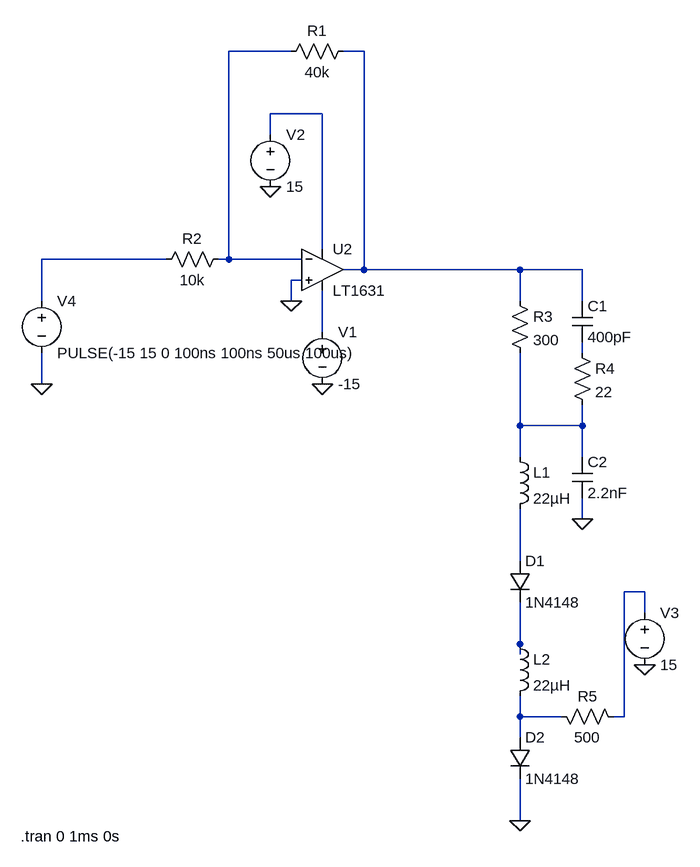
[diagram p0: schematic opamp_pindiodedriver_ltspice.asc]
opamp_pindiodedriver_ltspice.asc, the LTspice schematic file:
Version 4
SHEET 1 880 1016
WIRE 112 -208 16 -208
WIRE 224 -208 192 -208
WIRE 160 -112 80 -112
WIRE 80 -80 80 -112
WIRE 160 96 160 -112
WIRE -80 112 -272 112
WIRE 16 112 16 -208
WIRE 16 112 0 112
WIRE 128 112 16 112
WIRE 224 128 224 -208
WIRE 224 128 192 128
WIRE 464 128 224 128
WIRE 560 128 464 128
WIRE 128 144 112 144
WIRE -272 176 -272 112
WIRE 112 176 112 144
WIRE 464 176 464 128
WIRE 560 176 560 128
WIRE 160 224 160 160
WIRE 560 256 560 240
WIRE -272 304 -272 256
WIRE 464 368 464 256
WIRE 560 368 560 336
WIRE 560 368 464 368
WIRE 464 416 464 368
WIRE 560 416 560 368
WIRE 560 512 560 480
WIRE 464 576 464 496
WIRE 656 624 624 624
WIRE 656 656 656 624
WIRE 464 704 464 640
WIRE 464 720 464 704
WIRE 464 816 464 784
WIRE 528 816 464 816
WIRE 624 816 624 624
WIRE 624 816 608 816
WIRE 464 848 464 816
WIRE 464 976 464 912
FLAG 80 0 0
FLAG 160 304 0
FLAG 560 512 0
FLAG 464 976 0
FLAG 656 736 0
FLAG -272 304 0
FLAG 112 176 0
SYMBOL Opamps\\LT1631 160 64 R0
SYMATTR InstName U2
SYMBOL voltage 160 208 R0
WINDOW 123 0 0 Left 2
WINDOW 39 0 0 Left 2
SYMATTR InstName V1
SYMATTR Value -15
SYMBOL voltage 80 -96 R0
WINDOW 123 0 0 Left 2
WINDOW 39 0 0 Left 2
SYMATTR InstName V2
SYMATTR Value 15
SYMBOL res 208 -224 R90
WINDOW 0 0 56 VBottom 2
WINDOW 3 32 56 VTop 2
SYMATTR InstName R1
SYMATTR Value 40k
SYMBOL res 16 96 R90
WINDOW 0 0 56 VBottom 2
WINDOW 3 32 56 VTop 2
SYMATTR InstName R2
SYMATTR Value 10k
SYMBOL res 448 160 R0
SYMATTR InstName R3
SYMATTR Value 300
SYMBOL cap 544 176 R0
SYMATTR InstName C1
SYMATTR Value 400pF
SYMBOL res 544 240 R0
SYMATTR InstName R4
SYMATTR Value 22
SYMBOL cap 544 416 R0
SYMATTR InstName C2
SYMATTR Value 2.2nF
SYMBOL ind 448 400 R0
SYMATTR InstName L1
SYMATTR Value 22µH
SYMBOL diode 448 576 R0
SYMATTR InstName D1
SYMATTR Value 1N4148
SYMBOL ind 448 688 R0
SYMATTR InstName L2
SYMATTR Value 22µH
SYMBOL diode 448 848 R0
SYMATTR InstName D2
SYMATTR Value 1N4148
SYMBOL res 512 800 M90
WINDOW 0 0 56 VBottom 2
WINDOW 3 32 56 VTop 2
SYMATTR InstName R5
SYMATTR Value 500
SYMBOL voltage 656 640 R0
WINDOW 123 0 0 Left 2
WINDOW 39 0 0 Left 2
SYMATTR InstName V3
SYMATTR Value 15
SYMBOL voltage -272 160 R0
WINDOW 123 0 0 Left 2
WINDOW 39 0 0 Left 2
SYMATTR InstName V4
SYMATTR Value PULSE(-15 15 0 100ns 100ns 50us 100us)
TEXT -304 1000 Left 2 !.tran 0 1ms 0s

The netlist it stands for:
* opamp_pindiodedriver_ltspice.asc
XU2 0 N001 N003 N005 N002 LT1630  ; LT1631, pins In+ In- V+ V- OUT
V1 N005 0 -15
V2 N003 0 15
R1 N002 N001 40k
R2 N001 N004 10k
R3 N002 N007 300
C1 N002 N006 400pF
R4 N006 N007 22
C2 N007 0 2.2nF
L1 N007 N008 22µH
D1 N008 N010 1N4148
L2 N010 N011 22µH
D2 N011 0 1N4148
R5 N011 N009 500
V3 N009 0 15
V4 N004 0 PULSE(-15 15 0 100ns 100ns 50us 100us)
.model D D
.lib standard.dio
.tran 0 1ms 0s
.lib LTC.lib
.backanno
.end